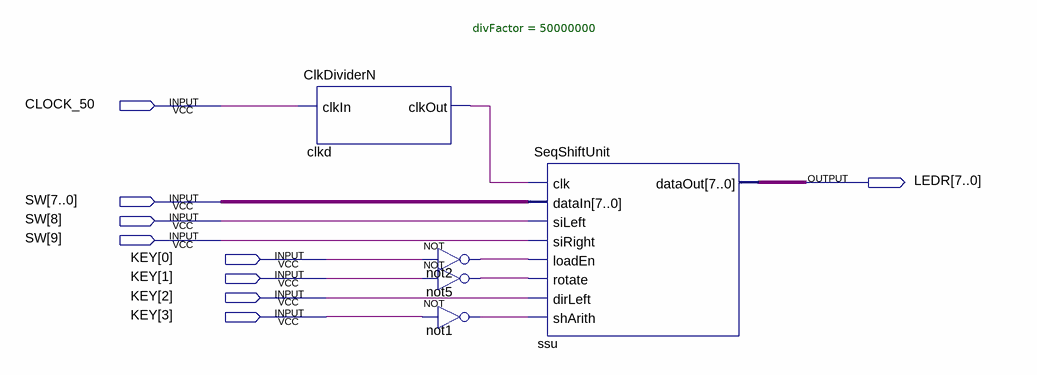
[diagram p0: schematic sheet]
// Quartus schematic SeqShiftUnit_Demo.bdf as structural Verilog: 5 symbols, 9 pins
module SeqShiftUnit_Demo (
  input  CLOCK_50,
  input  [9:0] SW,
  input  [3:0] KEY,
  output [7:0] LEDR
);

  wire clkd_clkout, not1_out, not2_out, not5_out;

  ClkDividerN #(.divFactor(50000000)) clkd (.clkIn(CLOCK_50), .clkOut(clkd_clkout));
  not not2 (not2_out, KEY[0]);
  not not5 (not5_out, KEY[1]);
  not not1 (not1_out, KEY[3]);
  SeqShiftUnit ssu (
    .clk(clkd_clkout), .dataIn(SW[7:0]), .siLeft(SW[8]), .siRight(SW[9]), .loadEn(not2_out),
    .rotate(not5_out), .dirLeft(KEY[2]), .shArith(not1_out), .dataOut(LEDR));
endmodule
